# EAGLE design display (EAGLE 4.16)
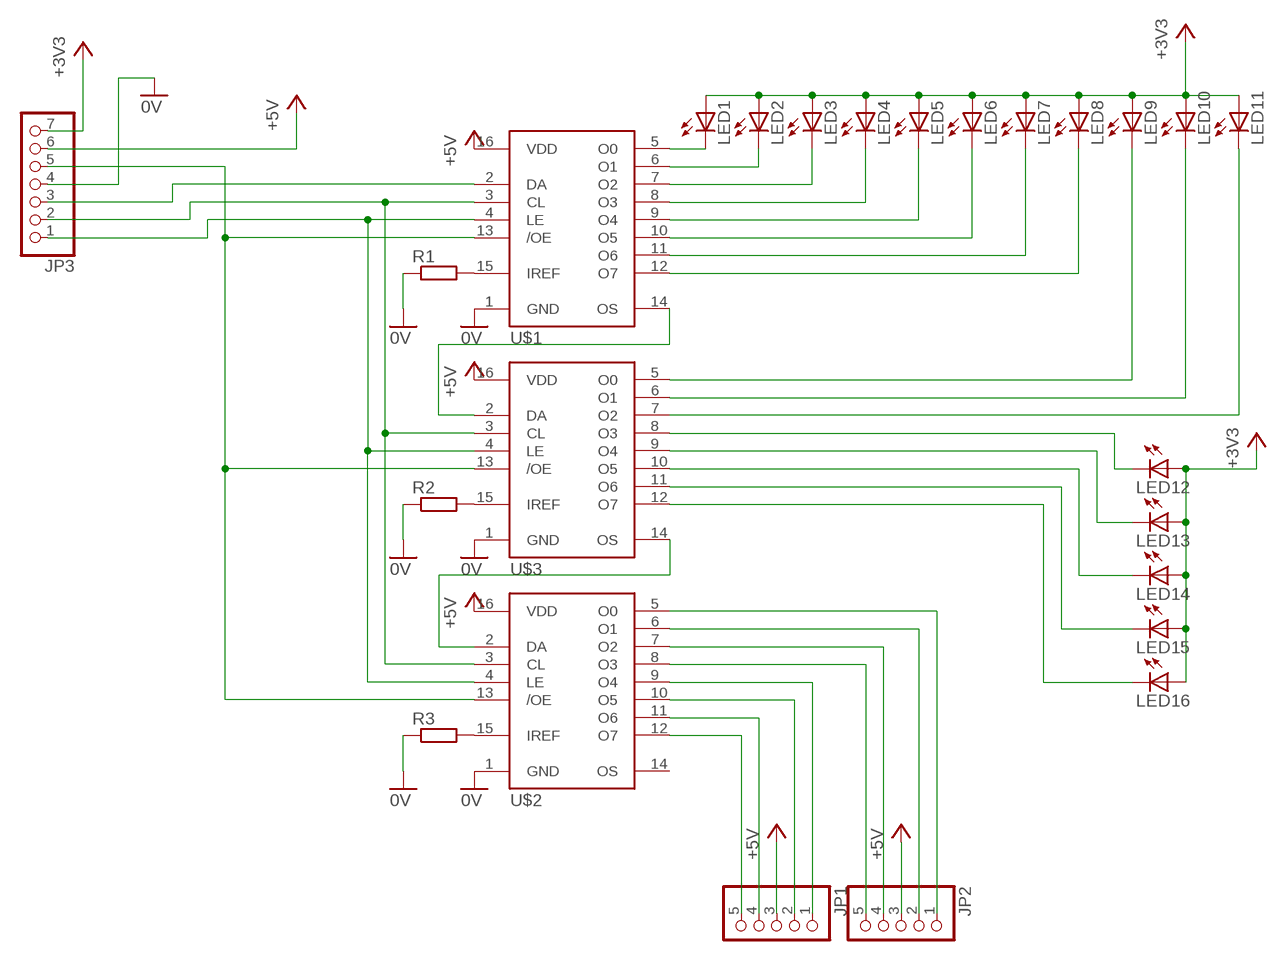
[diagram p0: schematic, sheet 1]

## Parts
JP1  PINHD-1X5  [1X05]
JP2  PINHD-1X5  [1X05]
JP3  PINHD-1X7  [1X07]
LED1  LED5MM  [LED5MM]
LED2  LED5MM  [LED5MM]
LED3  LED5MM  [LED5MM]
LED4  LED5MM  [LED5MM]
LED5  LED5MM  [LED5MM]
LED6  LED5MM  [LED5MM]
LED7  LED5MM  [LED5MM]
LED8  LED5MM  [LED5MM]
LED9  LED5MM  [LED5MM]
LED10  LED5MM  [LED5MM]
LED11  LED5MM  [LED5MM]
LED12  LED5MM  [LED5MM]
LED13  LED5MM  [LED5MM]
LED14  LED5MM  [LED5MM]
LED15  LED5MM  [LED5MM]
LED16  LED5MM  [LED5MM]
R1  R-EU_0204/7  [0204/7]
R2  R-EU_0204/7  [0204/7]
R3  R-EU_0204/7  [0204/7]
U$1  A6275  [SOIC16]
U$2  A6275  [SOIC16]
U$3  A6275  [SOIC16]

## Nets
0V: JP3.4 R1.1 R2.1 R3.1 U$1.1(GND) U$2.1(GND) U$3.1(GND)
+3V3: JP3.7 LED1.A LED2.A LED3.A LED4.A LED5.A LED6.A LED7.A LED8.A LED9.A LED10.A LED11.A LED12.A LED13.A LED14.A LED15.A LED16.A
+5V: JP1.3 JP2.3 JP3.6 U$1.16(VDD) U$2.16(VDD) U$3.16(VDD)
N$1: LED1.K(C) U$1.5(O0)
N$2: LED2.K(C) U$1.6(O1)
N$3: LED3.K(C) U$1.7(O2)
N$4: LED4.K(C) U$1.8(O3)
N$5: LED5.K(C) U$1.9(O4)
N$6: LED6.K(C) U$1.10(O5)
N$7: LED7.K(C) U$1.11(O6)
N$8: LED8.K(C) U$1.12(O7)
N$9: LED9.K(C) U$3.5(O0)
N$10: LED10.K(C) U$3.6(O1)
N$11: JP3.3 U$1.2(DA)
N$12: JP3.2 U$1.3(CL) U$2.3(CL) U$3.3(CL)
N$13: JP3.1 U$1.4(LE) U$2.4(LE) U$3.4(LE)
N$14: U$1.14(OS) U$3.2(DA)
N$15: U$2.2(DA) U$3.14(OS)
N$16: JP1.5 U$2.12(O7)
N$17: JP1.4 U$2.11(O6)
N$18: JP1.2 U$2.10(O5)
N$19: JP1.1 U$2.9(O4)
N$20: JP2.5 U$2.8(O3)
N$21: JP2.4 U$2.7(O2)
N$22: JP2.2 U$2.6(O1)
N$23: JP2.1 U$2.5(O0)
N$24: LED11.K(C) U$3.7(O2)
N$25: LED12.K(C) U$3.8(O3)
N$26: LED13.K(C) U$3.9(O4)
N$27: LED14.K(C) U$3.10(O5)
N$28: LED15.K(C) U$3.11(O6)
N$29: LED16.K(C) U$3.12(O7)
N$30: R1.2 U$1.15(IREF)
N$31: R2.2 U$3.15(IREF)
N$32: R3.2 U$2.15(IREF)
N$33: JP3.5 U$1.13(/OE) U$2.13(/OE) U$3.13(/OE)
Unconnected: U$2.14(OS)

## Library data of the parts
JP1 JP2 = pinhead:PINHD-1X5: PIN HEADER
JP3 = pinhead:PINHD-1X7: PIN HEADER
LED1-LED16 = led:LED: LED OSRAM: - CHIPLED LG R971, LG N971, LY N971, LG Q971, LY Q971, LO R971, LY R971 LH N974, LH R974 LS Q976, LO Q976, LY Q976 LO Q996 - Hyper CHIPLED LW Q18S LB Q993, LB Q99A, LB R99A - SideLED LS A670, LO A670, LY A670, LG A670, LP A670 LB A673, LV A673, LT A673, LW A673 LH A674 LY A675 LS A676, LA A676, LO A676, LY A676, LW A676 LS A679, LY A679, LG A679 - Hyper Micro SIDELED® LS Y876, LA Y876, LO Y876, LY Y876 LT Y87S - SmartLED LW L88C, LW L88S LB L89C, LB L89S, LG L890 LS L89K, LO L89K, LY L89K LS L896, LA L896, LO L896, LY L896 - TOPLED LS T670, LO T670, LY T670, LG T670, LP T670 LSG T670, LSP T670, LSY T670, LOP T670, LYG T670 LG T671, LOG T671, LSG T671 LB T673, LV T673, LT T673, LW T673 LH T674 LS T676, LA T676, LO T676, LY T676, LB T676, LH T676, LSB T676, LW T676 LB T67C, LV T67C, LT T67C, LS T67K, LO T67K, LY T67K, LW E67C LS E67B, LA E67B, LO E67B, LY E67B, LB E67C, LV E67C, LT E67C LW T67C LS T679, LY T679, LG T679 LS T770, LO T770, LY T770, LG T770, LP T770 LB T773, LV T773, LT T773, LW T773 LH T774 LS E675, LA E675, LY E675, LS T675 LS T776, LA T776, LO T776, LY T776, LB T776 LHGB T686 LT T68C, LB T68C - Hyper Mini TOPLED® LB M676 - Mini TOPLED Santana® LG M470 LS M47K, LO M47K, LY M47K Source: http://www.osram.convergy.de/
R1-R3 = rcl:R-EU_: RESISTOR, European symbol
U$1-U$3 = rnie04:A6275

## Board
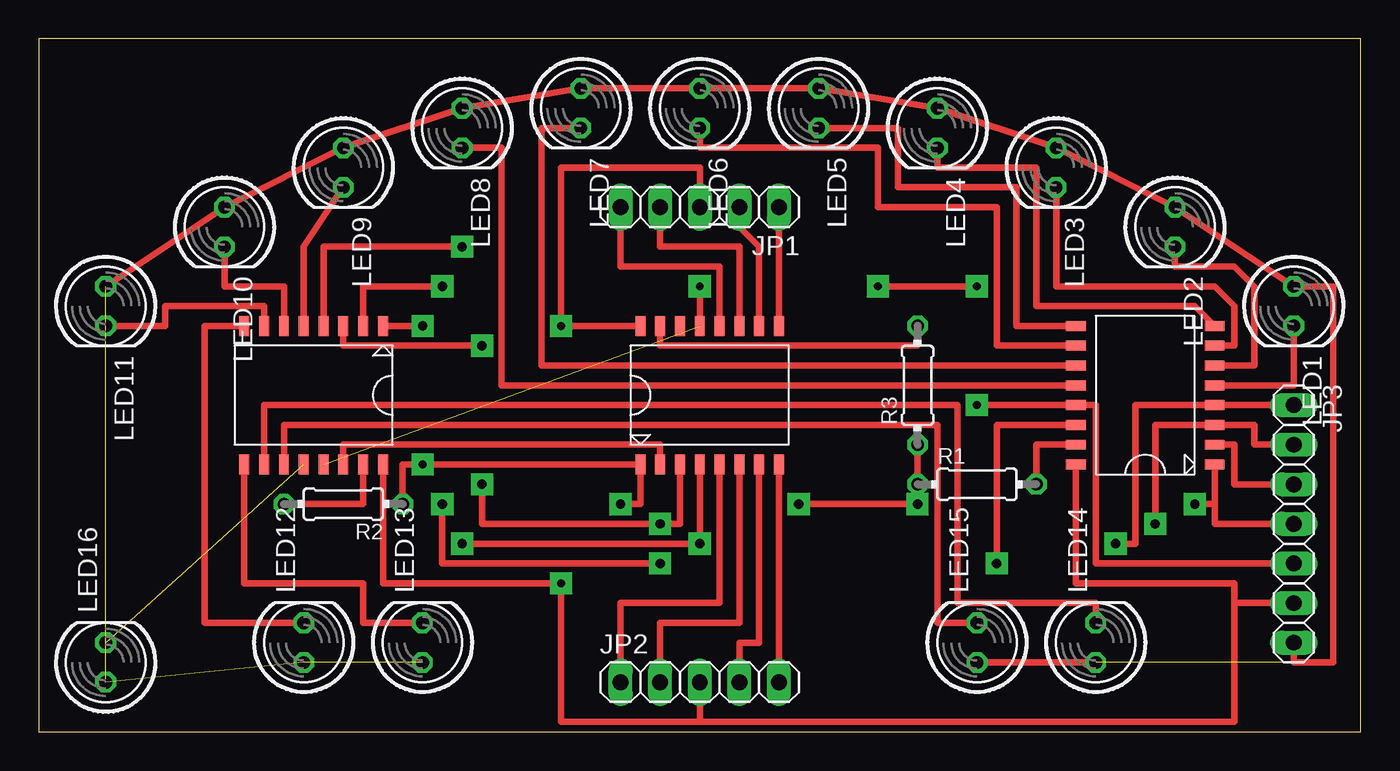
[diagram p1: board, top side]
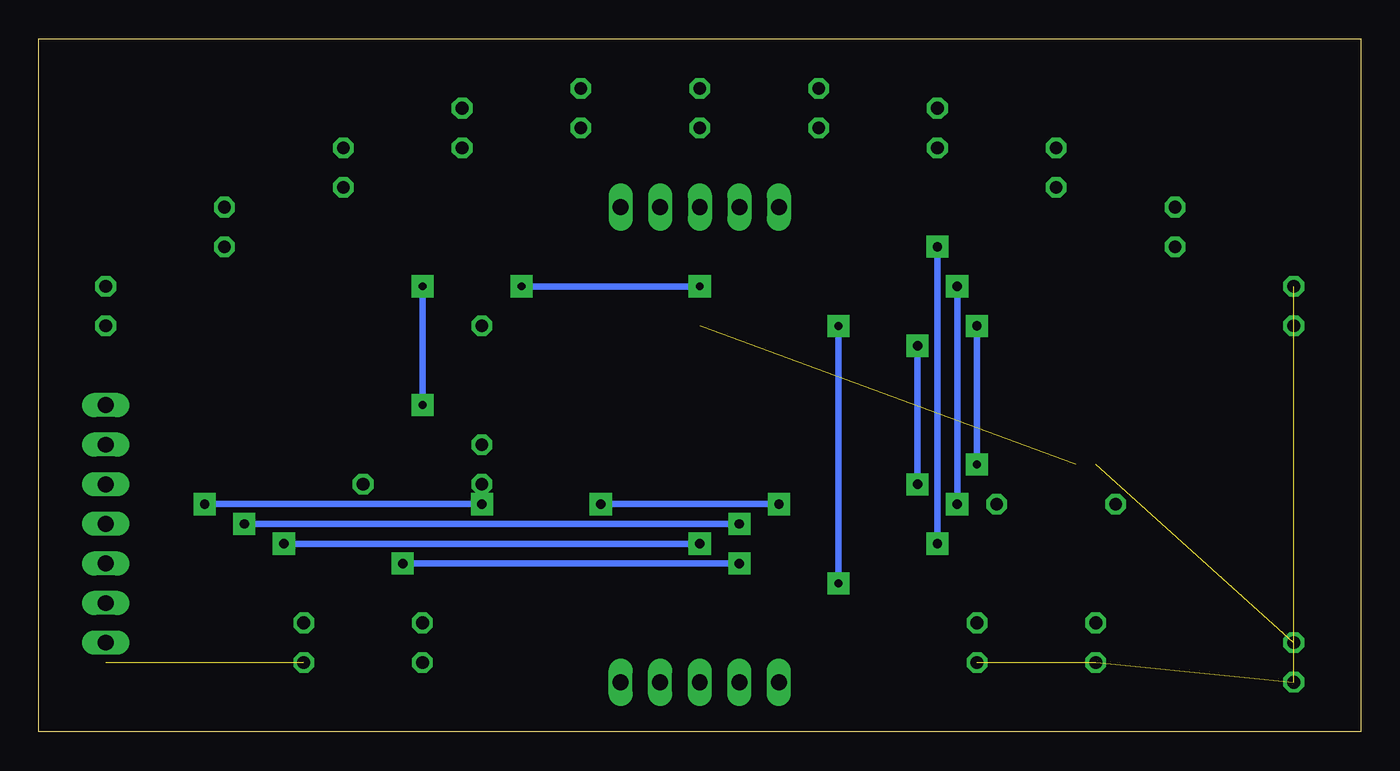
[diagram p2: board, bottom side, seen from below]

Size 84.76 x 44.44 mm. Coordinates in mm from the lower left corner, seen from the top.
Outline: 0,0 84.76,0 84.76,44.44 0,44.44 0,0
Copper layers (1*16): Top 0.035mm / dielectric 1.5mm / Bottom 0.035mm
Design rules "default": minimum track width 10mil, minimum drill 24mil, track to track 8mil, track to pad 8mil, pad to pad 8mil, via to via 8mil, smd to smd 8mil, copper to edge 40mil, drill to drill 8mil, minimum pad ring 10mil, minimum via ring 8mil, stop-mask expansion 4mil, vias tented up to drill 0mil, thermal gap 10mil

### Footprints (pad centres in the part's own frame; a part is rotated, then mirrored left to right if it is on the bottom)
1X05 = drill 1.016 long: 1 -5.08,0; 2 -2.54,0; 3 0,0; 4 2.54,0; 5 5.08,0
1X07 = drill 1.016 long: 1 -7.62,0; 2 -5.08,0; 3 -2.54,0; 4 0,0; 5 2.54,0; 6 5.08,0; 7 7.62,0
LED5MM = drill 0.813 octagon: A -1.27,0; K 1.27,0
0204/7 = drill 0.813 octagon: 1 -3.81,0; 2 3.81,0
SOIC16 = smd 1.27 x 0.635: 1 -2.54,2.54; 2 -2.54,1.27; 3 -2.54,0; 4 -2.54,-1.27; 5 -2.54,-2.54; 6 -2.54,-3.81; 7 -2.54,-5.08; 8 -2.54,-6.35; 9 6.35,-6.35; 10 6.35,-5.08; 11 6.35,-3.81; 12 6.35,-2.54; 13 6.35,-1.27; 14 6.35,0; 15 6.35,1.27; 16 6.35,2.54

### Placement (x,y rotation side)
JP1  42.38,33.65 180 top
JP2  42.38,3.17 0 top
JP3  80.48,13.33 270 top
LED1  80.48,27.3 270 top
LED2  72.86,32.38 270 top
LED3  65.24,36.19 270 top
LED4  57.62,38.73 270 top
LED5  50,40 270 top
LED6  42.38,40 270 top
LED7  34.76,40 270 top
LED8  27.14,38.73 270 top
LED9  19.52,36.19 270 top
LED10  11.9,32.38 270 top
LED11  4.28,27.3 270 top
LED12  16.98,5.71 90 top
LED13  24.6,5.71 90 top
LED14  67.78,5.71 90 top
LED15  60.16,5.71 90 top
LED16  4.28,4.44 90 top
R1  60.16,15.87 0 top
R2  19.52,14.6 180 top
R3  56.35,22.22 90 top
U$1  72.86,19.68 180 top
U$2  41.11,19.68 90 top
U$3  19.52,23.49 270 top

### Tracks (layer width: path | path; a pad name or v marks a point on that pad's centre or on a via)
0V  (via drill 0.5 pad 1.42, 0.6 pad 1.42)
  Top 0.406: v24.6,26.03 U$3.1 | 75.4,14.6 U$1.1 | v74.13,14.6 75.4,14.6 | v48.73,14.6 v56.35,14.6 R1.1 R3.1 | v37.3,14.6 38.57,14.6 U$2.1 v24.6,17.14 23.33,17.14 R2.1 | 75.4,14.6 75.4,13.33 JP3.4
  Bottom 0.406: v24.6,17.14 v24.6,26.03 | v56.35,14.6 v74.13,14.6 | v37.3,14.6 v48.73,14.6
+3V3  (4 unrouted)
  Top 0.406: LED6.A LED7.A LED8.A LED9.A LED10.A LED11.A | LED6.A LED5.A | LED5.A LED4.A LED3.A LED2.A LED1.A 83.02,28.57 83.02,4.44 80.48,4.44 JP3.7 | LED6.A LED5.A | LED15.A LED14.A
+5V  (via drill 0.5 pad 1.42)
  Top 0.406: U$2.16 v33.49,26.03 33.49,36.19 42.38,36.19 JP1.3 | U$1.16 66.51,9.52 76.67,9.52 76.67,8.25 | U$3.16 22.06,9.52 v33.49,9.52 33.49,0.63 42.38,0.63 | 76.67,8.25 JP3.6 | 42.38,0.63 JP2.3 | 76.67,8.25 76.67,0.63 42.38,0.63
  Bottom 0.406: v33.49,9.52 v33.49,26.03
N$1
  Top 0.406: LED1.K 80.48,22.22 U$1.5
N$2
  Top 0.406: LED2.K 72.86,29.84 76.67,29.84 77.94,28.57 77.94,23.49 U$1.6
N$3
  Top 0.406: LED3.K 65.24,28.57 75.4,28.57 76.67,27.3 76.67,24.76 U$1.7
N$4
  Top 0.406: LED4.K 57.62,36.19 63.97,36.19 63.97,27.3 74.13,27.3 U$1.8
N$5
  Top 0.406: LED5.K 55.08,38.73 55.08,34.92 62.7,34.92 62.7,26.03 U$1.9
N$6
  Top 0.406: LED6.K 42.38,37.46 53.81,37.46 53.81,33.65 61.43,33.65 61.43,24.76 U$1.10
N$7
  Top 0.406: LED7.K 32.22,38.73 32.22,23.49 U$1.11
N$8
  Top 0.406: LED8.K 29.68,37.46 29.68,22.22 U$1.12
N$9
  Top 0.406: LED9.K 16.98,31.11 U$3.5
N$10
  Top 0.406: LED10.K 11.9,28.57 15.71,28.57 U$3.6
N$11
  Top 0.406: U$1.2 76.67,18.41 76.67,15.87 JP3.3
N$12  (via drill 0.6 pad 1.42)
  Top 0.406: U$2.3 41.11,13.33 v39.84,13.33 28.41,13.33 v28.41,15.87 | U$3.3 19.52,24.76 v28.41,24.76 | v71.59,13.33 71.59,19.68 U$1.3 77.94,19.68 77.94,18.41 JP3.2
  Bottom 0.406: v28.41,15.87 v28.41,24.76 | v39.84,13.33 v71.59,13.33
N$13  (via drill 0.6 pad 1.42)
  Top 0.406: U$2.4 v42.38,12.06 v27.14,12.06 | U$3.4 18.25,31.11 v27.14,31.11 | v69.05,12.06 70.32,12.06 70.32,20.95 U$1.4 JP3.1
  Bottom 0.406: v27.14,12.06 v27.14,31.11 | v42.38,12.06 v69.05,12.06
N$14  (via drill 0.6 pad 1.42)
  Top 0.406: U$3.2 20.79,28.57 v25.87,28.57 | U$1.14 61.43,19.68 v61.43,10.79 | v39.84,10.79 25.87,10.79 v25.87,14.6
  Bottom 0.406: v39.84,10.79 v61.43,10.79 | v25.87,14.6 v25.87,28.57
N$15
  Top 0.406: U$2.2 39.84,18.41 19.52,18.41 U$3.14
N$16
  Top 0.406: JP1.5 37.3,29.84 43.65,29.84 U$2.12
N$17
  Top 0.406: JP1.4 39.84,31.11 44.92,31.11 U$2.11
N$18
  Top 0.406: JP1.2 44.92,32.38 46.19,31.11 U$2.10
N$19
  Top 0.406: U$2.9 JP1.1
N$20
  Top 0.406: JP2.5 U$2.8
N$21
  Top 0.406: JP2.4 44.92,5.71 46.19,5.71 U$2.7
N$22
  Top 0.406: JP2.2 39.84,6.98 44.92,6.98 U$2.6
N$23
  Top 0.406: JP2.1 37.3,8.25 43.65,8.25 U$2.5
N$24
  Top 0.406: LED11.K 8.09,26.03 8.09,27.3 14.44,27.3 U$3.7
N$25
  Top 0.406: U$3.8 10.63,26.03 10.63,6.98 LED12.K
N$26
  Top 0.406: U$3.9 13.17,9.52 20.79,9.52 20.79,6.98 LED13.K
N$27
  Top 0.406: U$3.10 14.44,20.95 58.89,20.95 58.89,8.25 67.78,8.25 LED14.K
N$28
  Top 0.406: U$3.11 15.71,19.68 57.62,19.68 57.62,6.98 LED15.K
N$29  (1 unrouted)
N$30
  Top 0.406: U$1.15 63.97,18.41 R1.2
N$31
  Top 0.406: R2.2 20.79,14.6 U$3.15
N$32
  Top 0.406: R3.2 56.35,24.76 39.84,24.76 U$2.15
N$33  (via drill 0.5 pad 1.42)  (1 unrouted)
  Top 0.406: JP3.5 67.78,10.79 67.78,20.95 U$1.13 v60.16,20.95 | v60.16,28.57 v53.81,28.57 | U$2.13 v42.38,28.57
  Bottom 0.406: v60.16,20.95 v60.16,28.57 | v42.38,28.57 v53.81,28.57